# Altium schematic sheet HVchannel.SchDoc
size A4; Author: Epshteyn L.; DrawnBy: Epshteyn L.
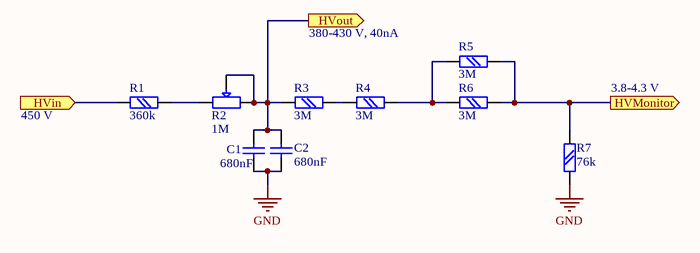
[diagram p0: HVchannel.SchDoc]

## Parts
C1  680nF  [C20P0_4]
C2  680nF  [C20P0_4]
R1  360k  [chip0805]
R2  1M  [SH-R114S]
R3  3M  [chip0805]
R4  3M  [chip0805]
R5  3M  [chip0805]
R6  3M  [chip0805]
R7  76k  [chip0805]

## Ports
HVin (in), HVMonitor (out), HVout (out)

## Nets
GND: C1.1 C2.1 R7.2
HVin: R1.1 ; port HVin
HVMonitor: R5.2 R6.2 R7.1 ; port HVMonitor
HVout: C1.2 C2.2 R2.2 R2.3 R3.1 ; port HVout
NetR1_2: R1.2 R2.1
NetR3_2: R3.2 R4.1
NetR4_2: R4.2 R5.1 R6.1

## Notes on the sheet
- 380-430 V, 40nA
- 450 V
- 3.8-4.3 V

## Library data of the parts
C1 C2 = Cap: Capacitor; Published: 8-Jun-2000; LatestRevisionDate: 17-Jul-2002; LatestRevisionNote: Re-released for DXP Platform.; PackageReference: RAD-0.3; Publisher: Altium Limited
R1 R3-R7 = R: Text Field1: 20; Text Field2: 20
R2 = R VAR: Text Field1: 20; Text Field2: 20